# EAGLE design Grove - Capacitive Moisture Sensor (Corrosion Resistant) (EAGLE 9.1.2)

## Sheet 1 of 2
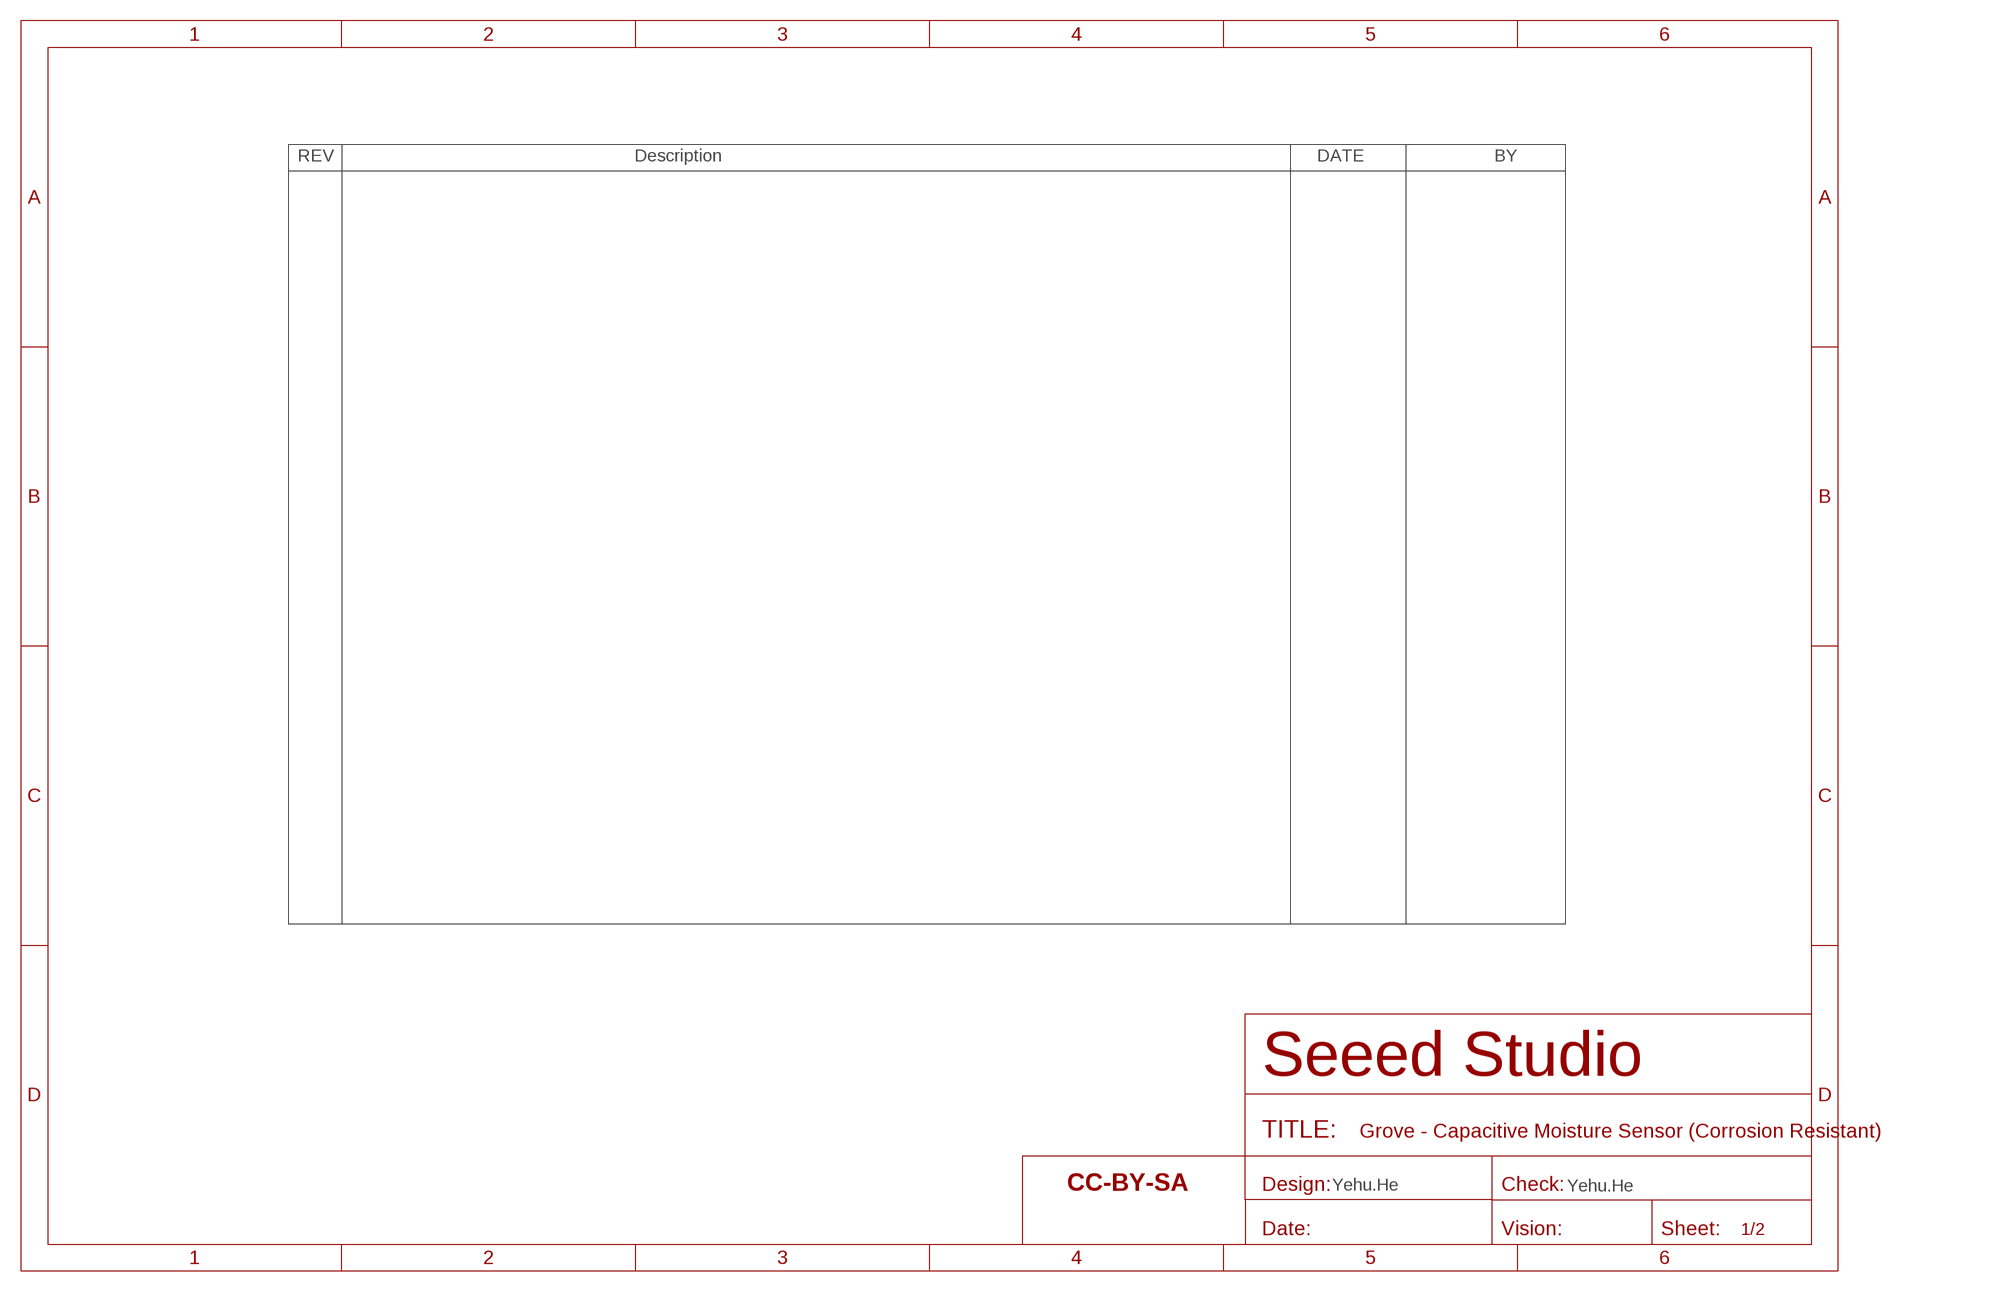
[diagram p0: schematic, sheet 1]

### Parts
FR1  SEEEDSTUDIO-OPEN-SCH-FRAME  [SEEEDSTUDIO-PCB-FRAME]

### Notes on the sheet
- Yehu.He | Yehu.He

## Sheet 2 of 2
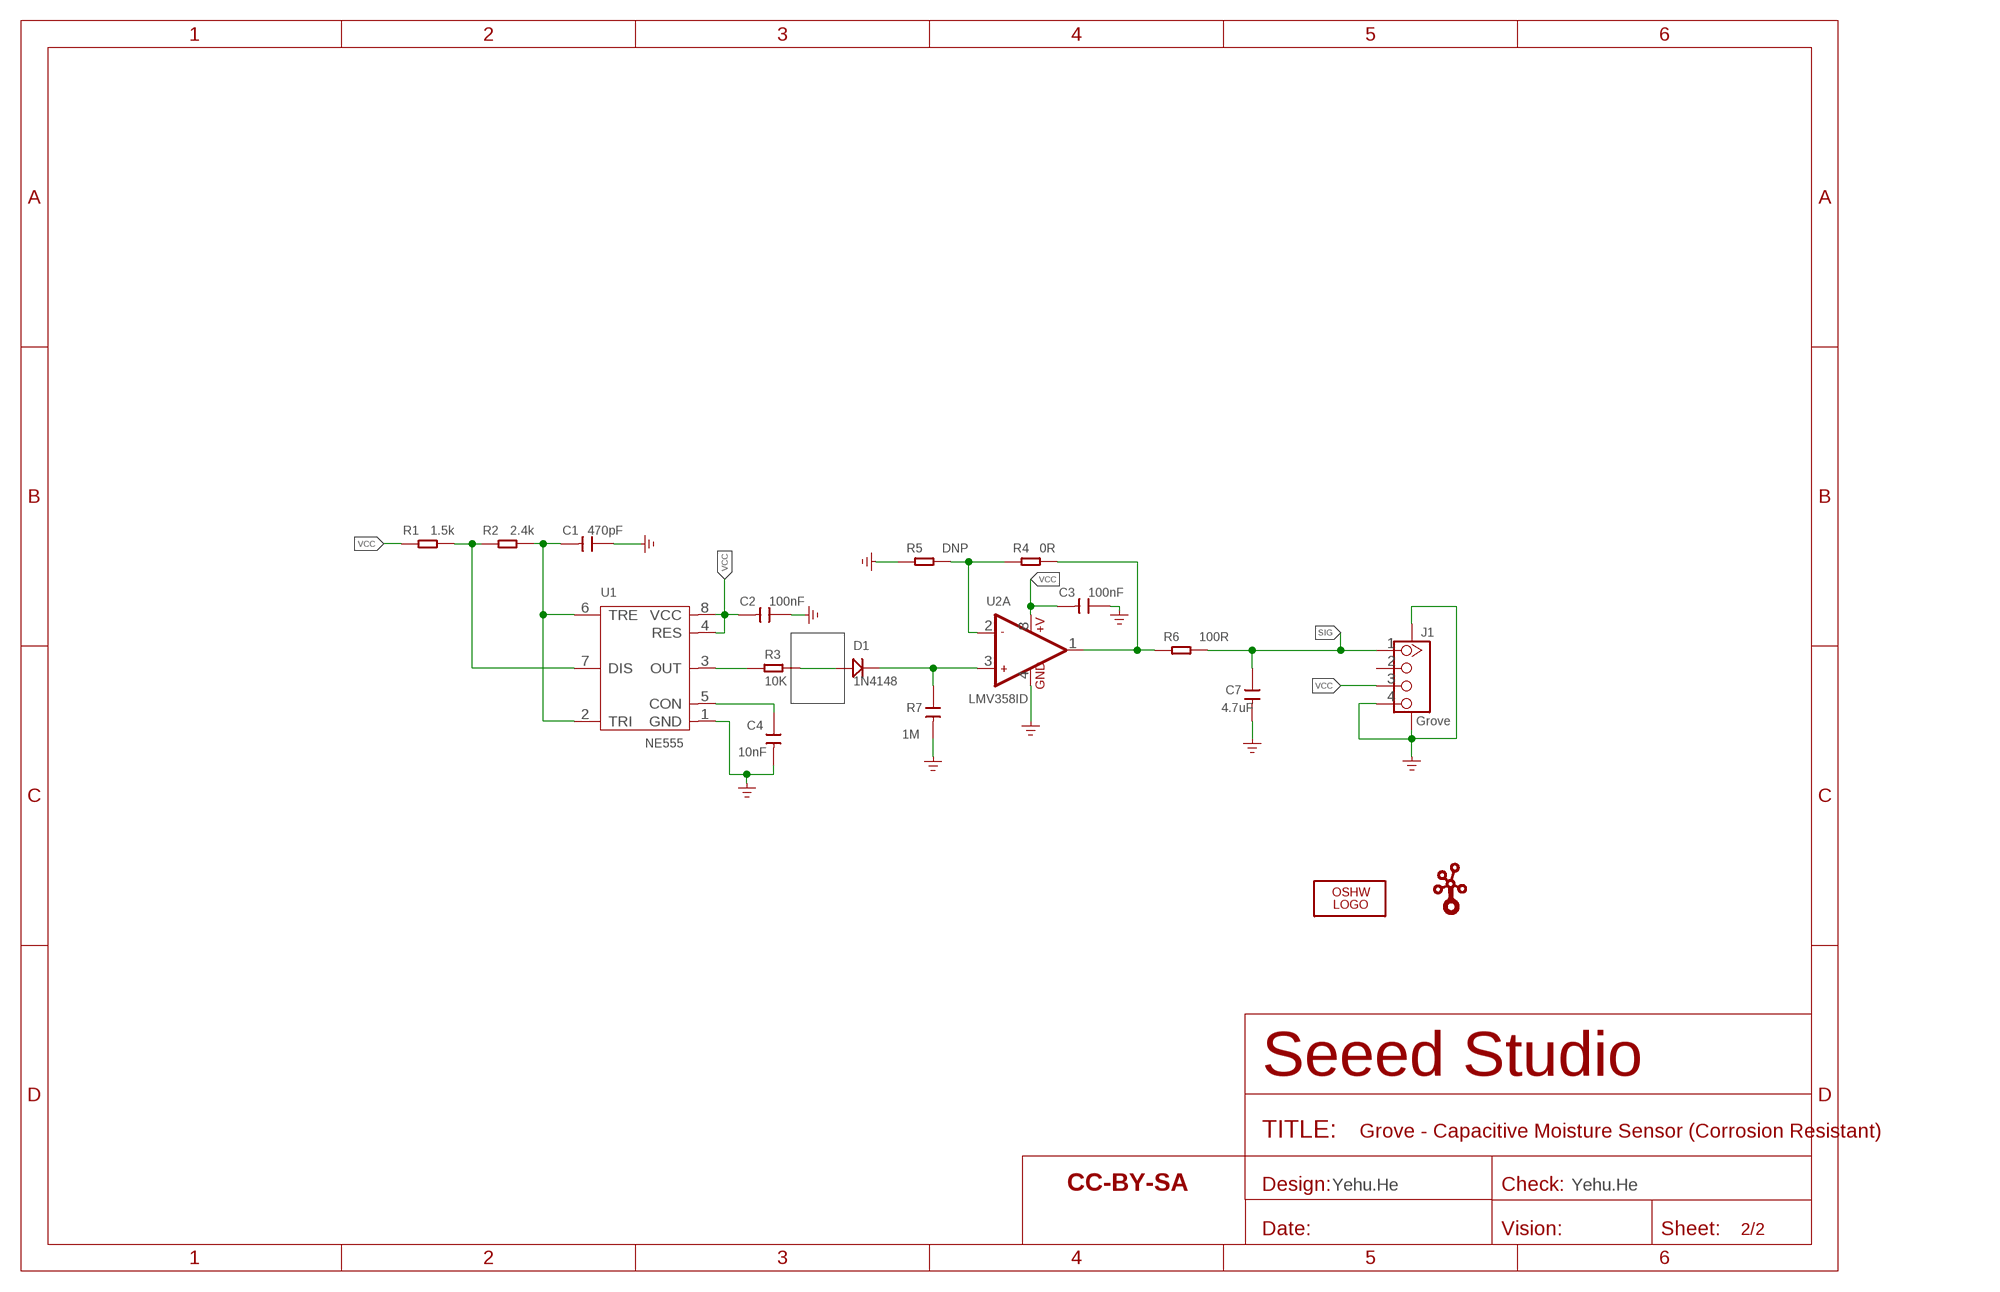
[diagram p1: schematic, sheet 2]

### Parts
C1  470pF  CAP-0603  [C0603]
C2  100nF  CAP-0603  [C0603]
C3  100nF  CAP-0603  [C0603]
C4  10nF  CAP-0603  [C0603]
C7  4.7uF  CAP-0603  [C0603]
D1  1N4148  DIODE'1N4148-SMD'  [LL-34]
FR2  SEEEDSTUDIO-OPEN-SCH-FRAME  [SEEEDSTUDIO-PCB-FRAME]
J1  Grove  GROVE-CONNECTOR-SMD'90D'  [HW4-SMD-2.0-90D]
LOGO1  LOGO-OSHW-FILLX0200-NT  [OSHW_FILLX200_NOTEXT]
R1  1.5k  RES-0603  [R0603]
R2  2.4k  RES-0603  [R0603]
R3  10K  RES-0603  [R0603]
R4  0R  RES-0603  [R0603]
R5  DNP  RES-0603  [R0603]
R6  100R  RES-0603  [R0603]
R7  1M  CAP-0603  [C0603]
U1  NE555  CLOCK/TIMING-NE555'DR'  [SOIC8-1.27-5X4MM]
U2  LMV358ID  AMPLIFIER-LMV358'D'  [SOIC8-1.27-5X4MM]
U$7  LOGO-GROVE  [GROVE-SILK-BIG]

### Nets
GND: C1.1 C2.1 C3.1 C4.2 C7.2 J1.4 J1.SS1 J1.SS2 R5.1 R7.2 U1.1(GND) U2.4(A:GND) ; supply symbol labelled GND_POWER
N$1: R1.1 R2.2 U1.7(DIS)
N$2: C1.2 R2.1 U1.2(TRI) U1.6(TRE)
N$3: C4.1 U1.5(CON)
N$4: R3.1 U1.3(OUT)
N$5: D1.A(+) R3.2
N$7: D1.C(-) R7.1 U2.3(A:+IN1)
N$8: R4.1 R5.2 U2.2(A:-IN1)
N$10: R4.2 R6.1 U2.1(A:OUT1)
SIG: C7.1 J1.1 R6.2
VCC: C2.2 C3.2 J1.3 R1.2 U1.4(RES) U1.8(VCC) U2.8(A:+V)
Unconnected: J1.2 U2.5(B:+IN2) U2.6(B:-IN2) U2.7(B:OUT2)

### Notes on the sheet
- Yehu.He | Yehu.He

## Library data of the parts
C1-C4 C7 R7 = Discrete-new:CAP: Ceramic Capacitors
D1 = Discrete-new:DIODE*
FR1 FR2 = moudle-new:SEEEDSTUDIO-OPEN-SCH-FRAME
J1 = Connector-new:GROVE-CONNECTOR-SMD: 4P-SMD-2.0:320110030;4P-SMD-2.0-90D:320110032
LOGO1 = logo:LOGO-OSHW-FILL; PARTNO: DNP
R1-R6 = Discrete-new:RES
U1 = IC-new:CLOCK/TIMING-NE555: DIP-8:310110001;SOIC-8:310110013;TSSOP-8:310110002
U2 = IC-new:AMPLIFIER-LMV358: SOIC-8:310020002;MSOP-8:310020007; SKU: 222
U$7 = logo:LOGO-GROVE; PARTNO: DNP

## Board
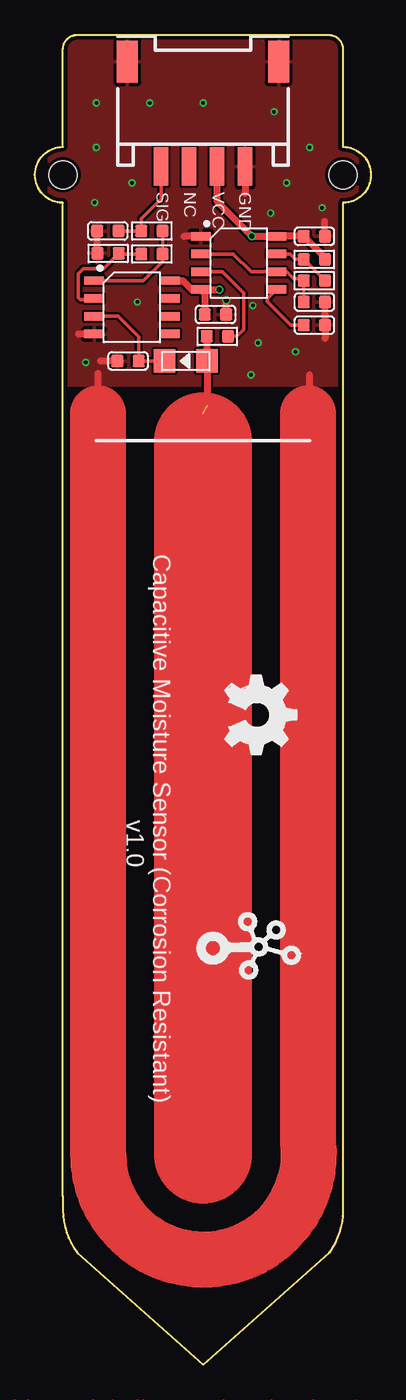
[diagram p2: board, top side]
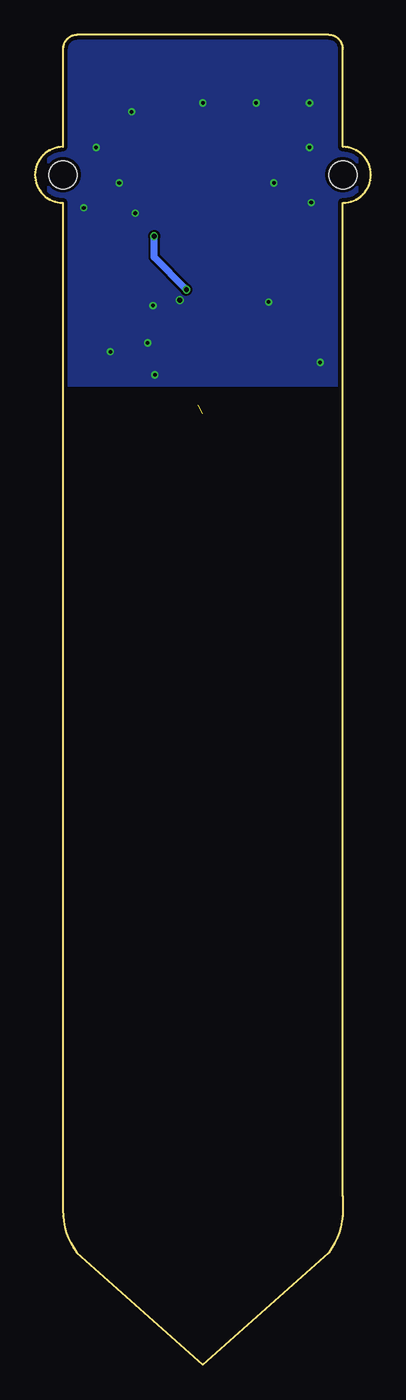
[diagram p3: board, bottom side, seen from below]

Size 24 x 95.03 mm. Coordinates in mm from the lower left corner, seen from the top.
Outline: 3,95.03 21,95.03
Outline: 3,95.03 21,95.03
Outline: 21,95.03 arc-90 22,94.03 22,87.03 arc-180 22,83.03 22,12.03
Outline: 2,12.03 2,83.03 arc-180 2,87.03 2,94.03 arc-90 3,95.03
Outline: 2,12.03 2,11.03 arc37 3.01,8 12.01,0 21.01,8 arc37 22,11.03 22,12.03
Copper layers (1*16): Top 0.035mm / dielectric 1.5mm / Bottom 0.035mm
Design rules "SeeedStudio_2layer_DRU_no_angle_20140221": minimum track width 1mil, minimum drill 10mil, track to track 6mil, track to pad 6mil, pad to pad 6mil, via to via 6mil, smd to smd 0mil, copper to edge 10mil, drill to drill 10mil, minimum pad ring 4mil, minimum via ring 4mil, stop-mask expansion 2mil, vias tented up to drill 25mil, thermal gap 10mil
Holes 2 mm at 2,85.03 22,85.03

### Footprints (pad centres in the part's own frame; a part is rotated, then mirrored left to right if it is on the bottom)
C0603 = smd 0.889 x 0.889: 1 0,0.762; 2 0,-0.762
LL-34 = smd 1.524 x 1.676: A 1.524,0; C -1.524,0
HW4-SMD-2.0-90D = smd 1.01 x 2.74: 1 -3,-0.1; 2 -1,-0.1; 3 1,-0.1; 4 3,-0.1 | smd 1.5 x 3: SS1 -5.4,7.4; SS2 5.4,7.4
R0603 = smd 0.889 x 0.889: 1 0,0.762; 2 0,-0.762
SOIC8-1.27-5X4MM = smd 0.6 x 1.4: 1 -1.905,-2.7; 2 -0.635,-2.7; 3 0.635,-2.7; 4 1.905,-2.7; 5 1.905,2.7; 6 0.635,2.7; 7 -0.635,2.7; 8 -1.905,2.7

### Placement (x,y rotation side)
C1  19.97,75.94 270 top
C2  19.97,80.64 270 top
C3  12.9,75.06 270 top
C4  19.97,74.29 90 top
C7  5.2,81.03 270 top
D1  10.77,71.73 0 top
FR1  -2.72,-15.24 0 top  (outside the outline)
FR2  -2.72,-7.62 0 top  (outside the outline)
J1  12.01,85.73 0 top
LOGO1  13.58,49.28 270 top
R1  19.97,78.99 90 top
R2  19.97,77.47 90 top
R3  13.03,73.5 270 top
R4  8.35,79.38 90 top
R5  5.23,79.43 90 top
R6  8.35,81.03 270 top
R7  6.65,71.73 270 top
U1  14.55,78.74 270 top
U2  6.93,75.56 270 top
U$7  12.52,29.82 270 top

### Tracks (layer width: path | path; a pad name or v marks a point on that pad's centre or on a via)
GND  (via drill 0.25 pad 0.51, 0.35)
  Top 0.254: 4.25,68 4.51,68 4.51,69.19 | 20.76,68 19.51,68 19.63,68.12 19.63,69.04 | 4.51,70.86 4.52,70.87
  Top 0.508: C1.1 C4.2 20.73,73.36 20.72,73.36 | U1.1 10.66,80.64 | R5.1 4.46,81 C7.2 | J1.4 15.01,83.69 | C2.1 20.7,80.67 20.7,81.71 | R7.2 4.69,71.73 | 4.51,69.19 4.51,70.86 | U2.4 3.09,73.66 | 19.63,69.04 19.63,70.74 | C3.1 v13.66,76.07
  Top 4: 19.51,68 19.51,15.97 arc-187 4.51,15.03 4.51,68
  other vias: 6.93,84.45 4.39,90.17 8.2,90.17 12.01,90.17 17.09,89.53 19.63,87 4.39,87 4.26,83.06 3.63,71.63 15.44,70.74 15.95,73.03 18.61,72.39 15.56,75.69 16.83,82.3 20.52,82.68 17.98,84.45 7.31,75.95
  pour Top: 1.01,96 23.01,96 23.01,70 1.01,70
  pour Bottom: 1.01,96 23.01,96 23.01,70 1.01,70
N$1
  Top 0.254: R2.2 R1.1 18.61,78.99 18.23,79.37 U1.7
N$2
  Top 0.254: C1.2 R2.1 19.07,77.6 18.49,77.6 17.98,78.1 U1.6 | U1.6 | U1.2 14.17,79.37 15.44,78.1 U1.6
N$3
  Top 0.254: C4.1 18.26,74.29 16.59,75.96 16.59,76.18 U1.5
N$4
  Top 0.254: U1.3 13.38,78.1 14.9,76.58 14.9,73.97 14.43,73.5 R3.1
N$5  (1 unrouted)
  Top 0.254: 12.01,66 12.01,67.96 | 12.29,72.01 D1.A
  Top 0.508: R3.2 12.27,72.03 12.29,72.01 | D1.A 12.29,68.63 12.34,68.58
  Top 0.635: 12,67.96 12.01,67.96
  Top 7: 12.01,15 12.01,66
N$7
  Top 0.254: D1.C R7.1 7.41,73.48 5.96,74.93 U2.3
N$8
  Top 0.254: R4.1 6.04,79.38 R5.2 4.9,78.33 3.45,78.33 3.09,77.98 3.09,76.25 3.25,76.1 4.13,76.1 U2.2
N$10
  Top 0.254: R6.1 R4.2 9.11,78.84 7.74,77.47 U2.1
SIG
  Top 0.254: 8.71,85.32 J1.1 9.01,85.34 9.01,84.66 9.01,83.33 7.59,81.92 R6.2 C7.1
VCC  (via drill 0.35)
  Top 0.508: R1.2 20.73,79.12 C2.2 U1.8 v15.49,80.64 13.02,83.11 13.02,84.96 12.9,85.09 13.01,85.2 J1.3 | U2.8 10.56,77.47 11.25,76.78 11.8,76.78 U1.4 | v13.18,76.83 v13.17,76.83 U1.4 | U1.4 12.14,76.55 C3.2
  Bottom 0.508: v13.18,76.83 15.49,79.15 v15.49,80.64

### Text on the board
tNames: SIG | NC | VCC | GND | Capacitive Moisture Sensor (Corrosion Resistant) / v1.0